# EAGLE design Rx_ckt_1 (EAGLE 9.6.2)
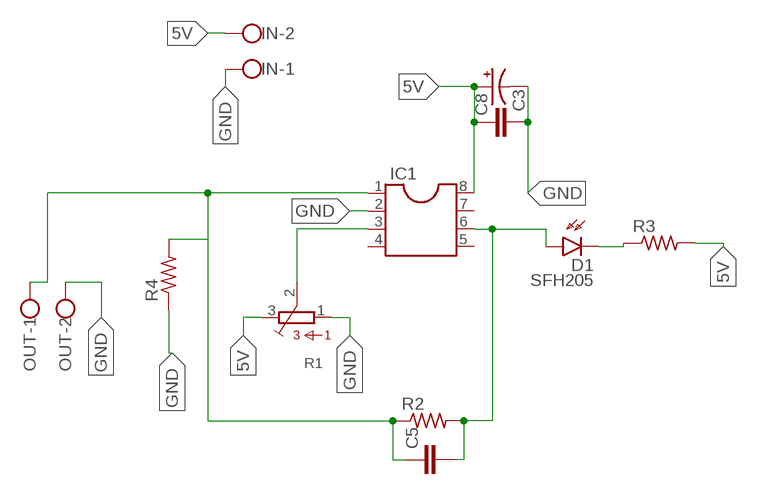
[diagram p0: schematic, sheet 1]

## Parts
C3  C-EU050-025X075  [C050-025X075]
C5  C-EU050-025X075  [C050-025X075]
C8  CPOL-USE2.5-7  [E2,5-7]
D1  SFH205  [SFH205]
IC1  DIL8  [DIL08]
IN  W237-102  [W237-102]
OUT  W237-102  [W237-102]
R1  3386-F  [3386F]
R2  R-US_0207/10  [0207/10]
R3  R-US_0207/10  [0207/10]
R4  R-US_0207/10  [0207/10]

## Nets
5V: C3.2 C8.+ IC1.8 IN.2 R1.3 R3.2
GND: C3.1 C8.- IC1.2 IN.1 OUT.2 R1.1 R4.1
N$1: IC1.3 R1.2
N$2: C5.1 IC1.1 OUT.1 R2.1 R4.2
N$3: C5.2 D1.A IC1.6 R2.2
N$5: D1.K(C) R3.1
Unconnected: IC1.4 IC1.5 IC1.7

## Library data of the parts
C3 C5 = rcl:C-EU: CAPACITOR, European symbol; SPICEPREFIX: C
C8 = rcl:CPOL-US: POLARIZED CAPACITOR, American symbol; SPICEPREFIX: C
D1 = opto-trans-siemens:SFH205: PHOTO DIODE; OC_FARNELL: unknown; OC_NEWARK: unknown
IC1 = ic-package:DIL8: Dual In Line / Socket
IN OUT = con-wago-500:W237-102: WAGO SCREW CLAMP; MPN: 237-102; OC_FARNELL: unknown; OC_NEWARK: 70K9898
R1 = bourns:3386-: 3386 Series 3/8" Square Trimmer
R2-R4 = rcl:R-US_: RESISTOR, American symbol; SPICEPREFIX: R

## Board
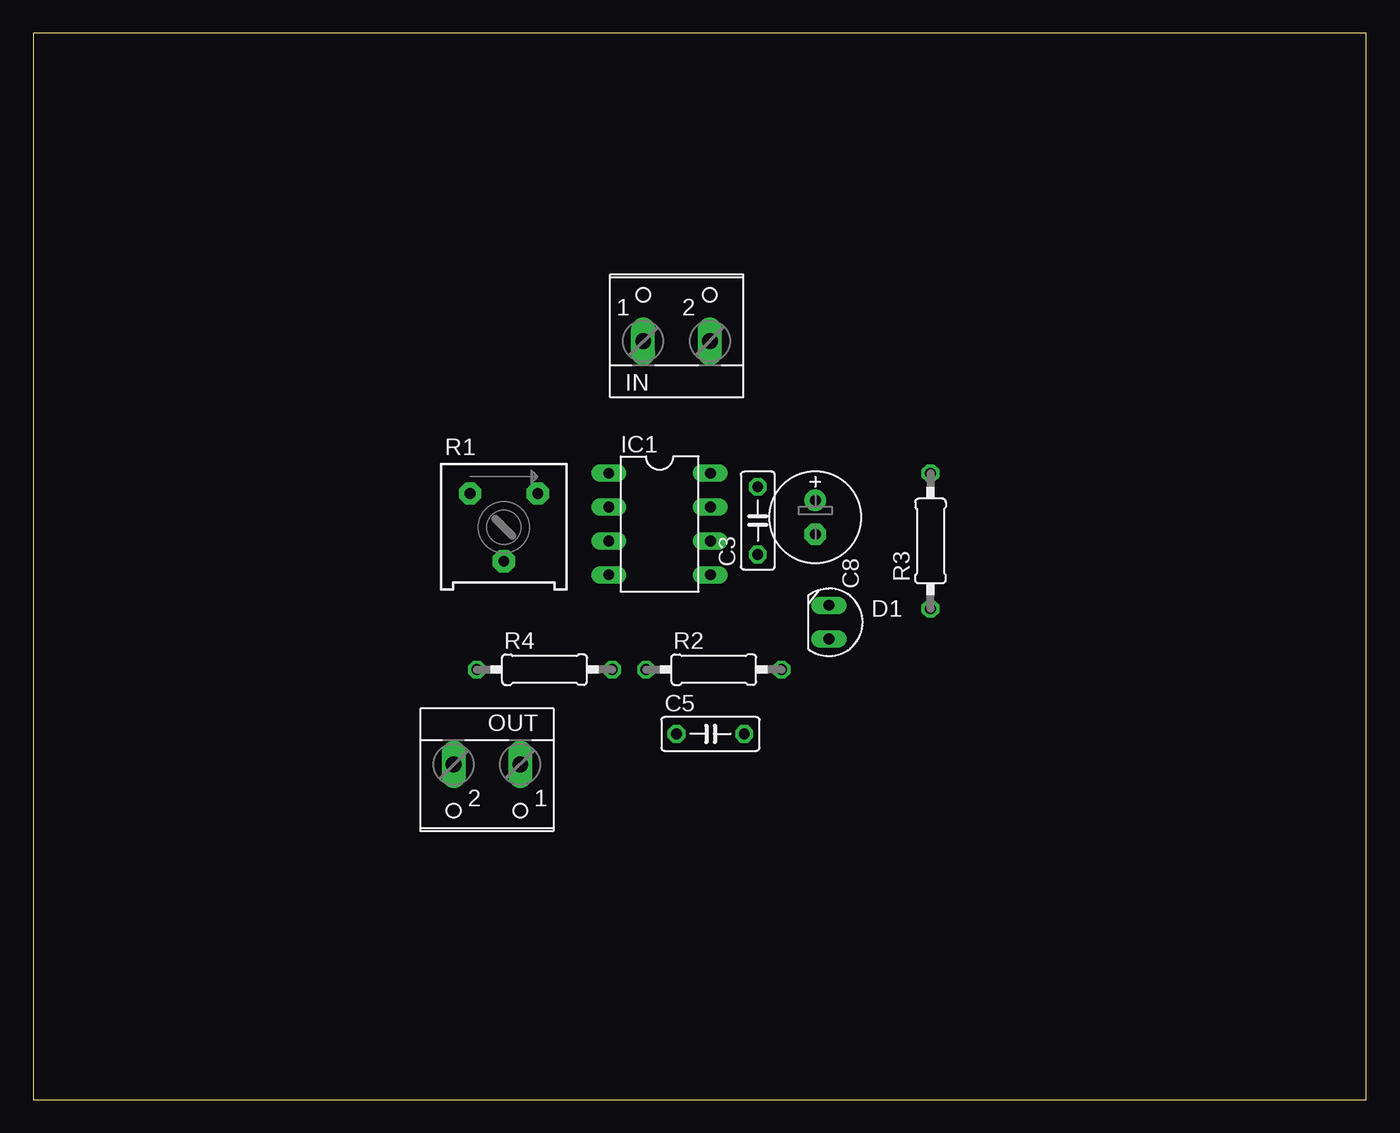
[diagram p1: board, top side]
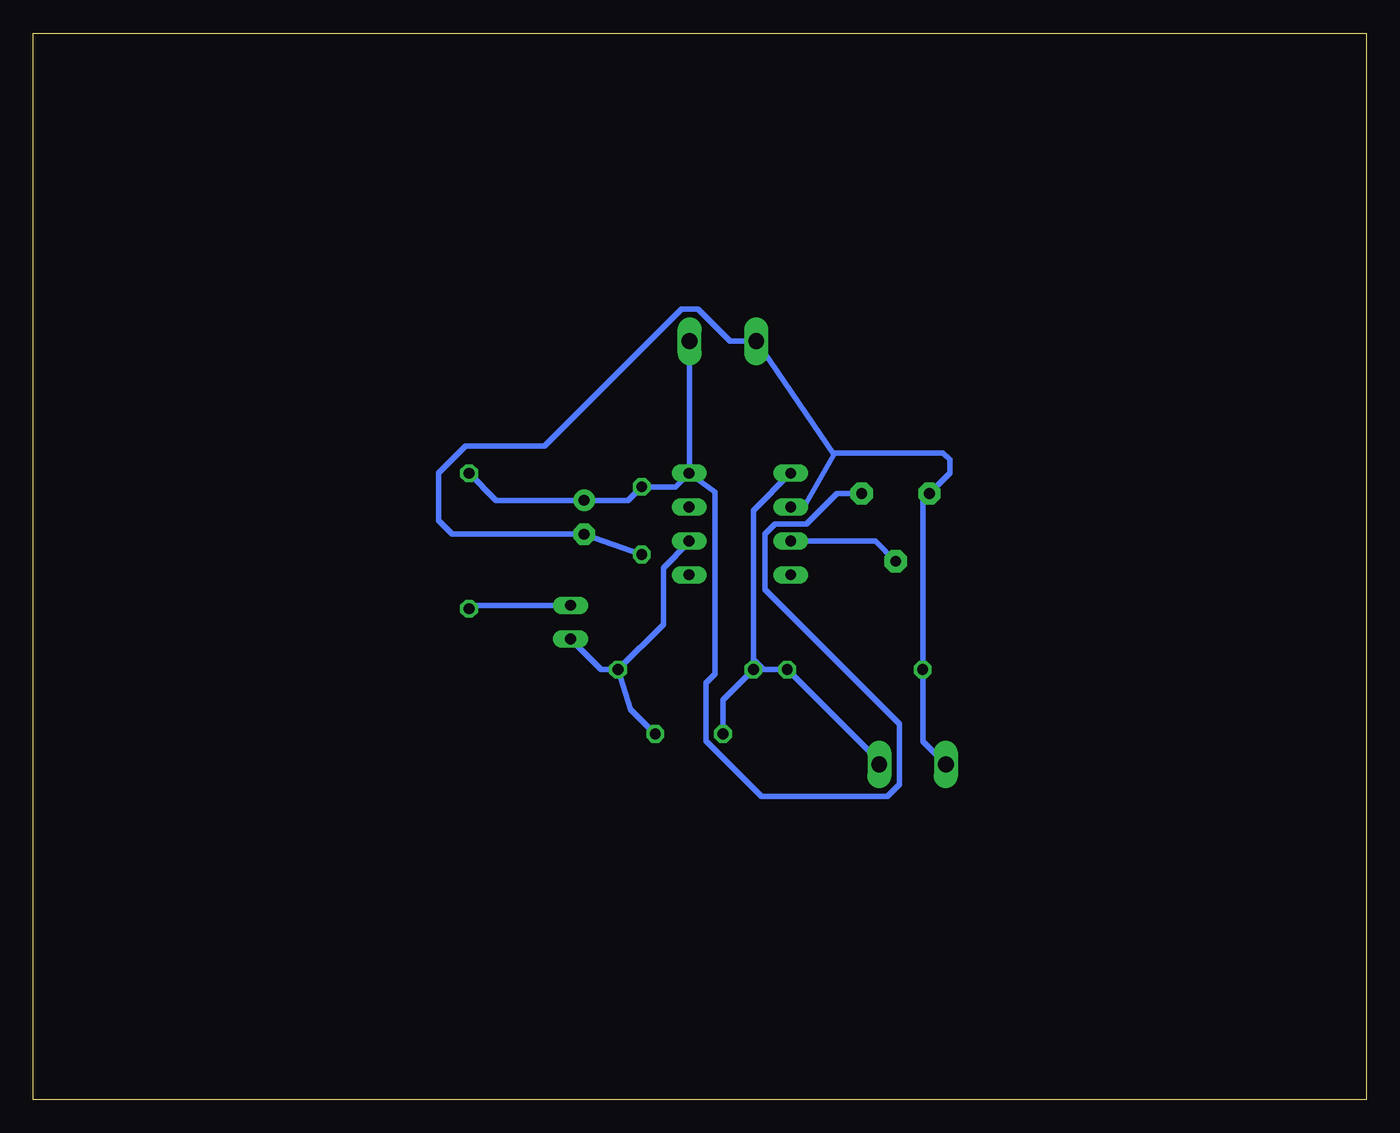
[diagram p2: board, bottom side, seen from below]

Size 100 x 80 mm. Coordinates in mm from the lower left corner, seen from the top.
Outline: 0,0 100,0 100,80 0,80 0,0
Copper layers (1*16): Top 0.035mm / dielectric 1.5mm / Bottom 0.035mm
Design rules "default *": minimum track width 16mil, minimum drill 0.8mm, track to track 16mil, track to pad 16mil, pad to pad 16mil, via to via 16mil, smd to smd 16mil, copper to edge 40mil, drill to drill 6mil, minimum pad ring 10mil, minimum via ring 8mil, stop-mask expansion 4mil, vias tented up to drill 0mil, thermal gap 10mil

### Footprints (pad centres in the part's own frame; a part is rotated, then mirrored left to right if it is on the bottom)
C050-025X075 = drill 0.813 octagon: 1 -2.54,0; 2 2.54,0
E2,5-7 = drill 0.813 pad 1.6: + -1.27,0 | drill 0.813 pad 1.6 octagon: - 1.27,0
SFH205 = drill 0.813 long: A 0,-1.27; K 0,1.27
DIL08 = drill 0.813 long: 1 -3.81,-3.81; 2 -1.27,-3.81; 3 1.27,-3.81; 4 3.81,-3.81; 5 3.81,3.81; 6 1.27,3.81; 7 -1.27,3.81; 8 -3.81,3.81
W237-102 = drill 1.194 long: 1 -2.5,-1.27; 2 2.5,-1.27
3386F = drill 0.813 pad 1.676 octagon: 1 -2.54,2.54; 2 0,-2.54; 3 2.54,2.54
0207/10 = drill 0.813 octagon: 1 -5.08,0; 2 5.08,0

### Placement (x,y rotation side)
C3  54.36,43.43 90 top
C5  50.8,27.43 0 top
C8  58.67,43.69 270 top
D1  59.69,35.81 0 top
IC1  46.99,43.18 270 top
IN  48.26,58.17 0 top
OUT  34.04,23.88 180 top
R1  35.31,42.93 0 top
R2  51.05,32.26 0 top
R3  67.31,41.91 90 top
R4  38.35,32.26 0 top

### Tracks (layer width: path | path; a pad name or v marks a point on that pad's centre or on a via)
5V
  Bottom 0.406: R3.2 65.28,44.96 C8.+ 55.37,44.96 C3.2 51.82,45.97 IC1.8 | IC1.8 50.76,47.03 IN.2 | R1.3 39.71,45.47 41.99,43.18 44.37,43.18 45.11,42.44 45.11,38.27 35.03,28.19 35.03,23.63 35.91,22.75 45.37,22.75 49.53,26.91 49.53,31.26 48.87,31.92 48.87,45.57 IC1.8
GND
  Bottom 0.406: C3.1 58.65,42.4 C8.- 68.58,42.42 69.6,43.43 69.6,46.99 67.56,49.02 61.66,49.02 51.38,59.3 50.14,59.3 47.74,56.9 IN.1 39.94,48.4 | OUT.2 33.27,26.88 R4.1 33.27,44.96 R1.1 31.24,46.99 31.24,48.01 31.75,48.51 39.88,48.51 39.94,48.4 | 39.94,48.4 42.16,44.45 IC1.2
N$1
  Bottom 0.406: R1.2 36.83,41.91 IC1.3
N$2
  Bottom 0.406: R2.1 45.21,32.26 | 45.21,32.26 R4.2 36.54,25.36 OUT.1 | R2.1 48.26,29.97 C5.1 | IC1.1 45.97,44.2 45.97,33.02 | 45.97,33.02 R2.1 | 45.97,33.02 45.59,32.64 | 45.59,32.64 45.21,32.26 | R2.1 45.59,32.64
N$3
  Bottom 0.406: D1.A 57.4,32.26 R2.2 | C5.2 55.19,29.28 R2.2 | R2.2 52.73,35.66 52.73,39.9 50.8,41.83 IC1.6
N$5
  Bottom 0.406: R3.1 67.06,37.08 D1.K